# EAGLE design SimulatorT2InterfaceRevD (EAGLE 7.7.0)
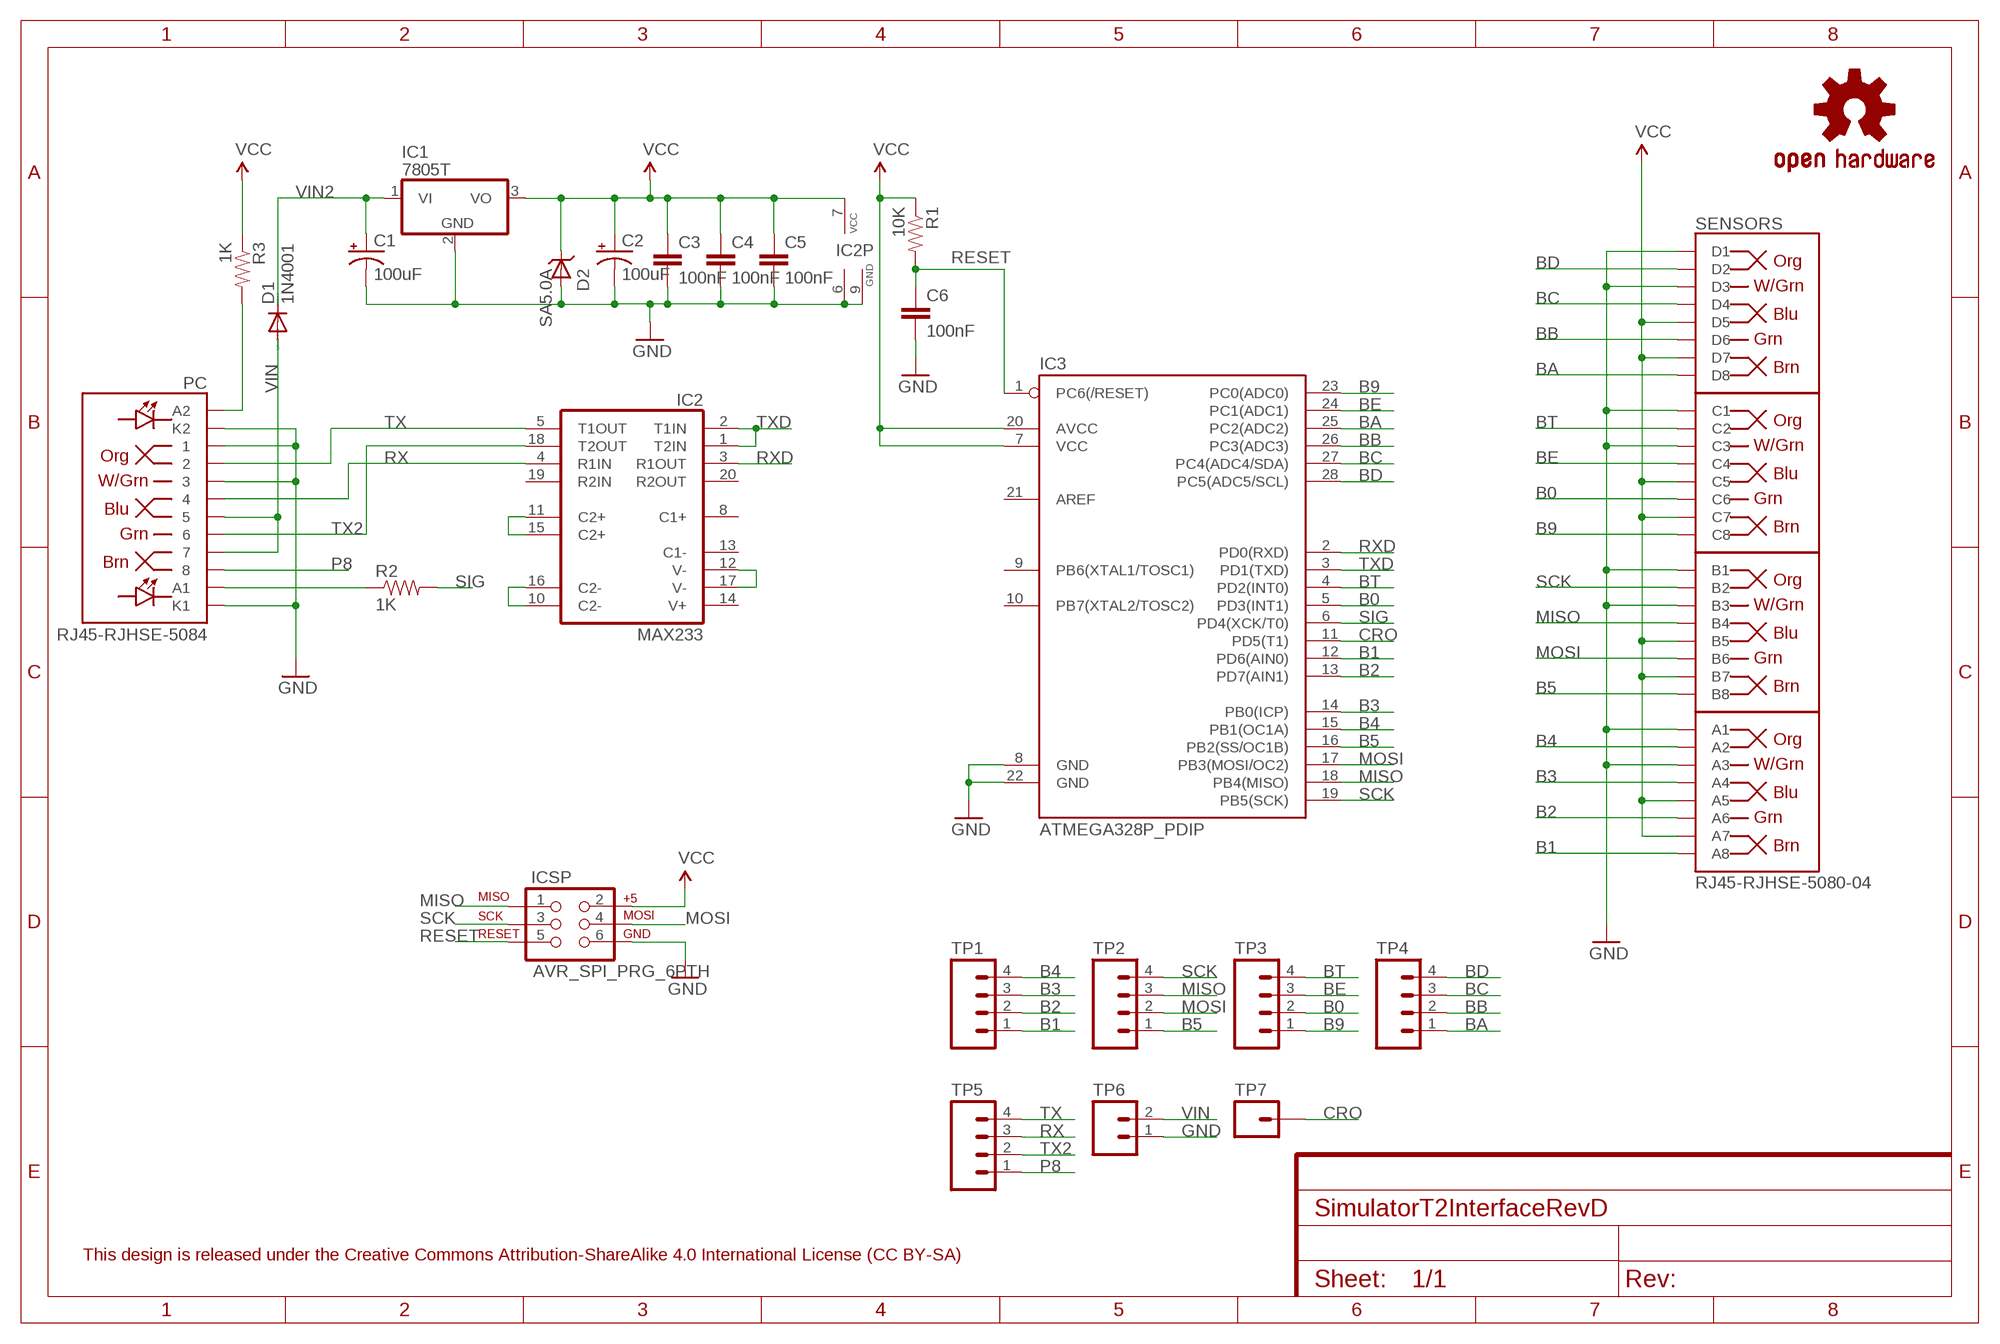
[diagram p0: schematic, sheet 1]
FRAME1 (FRAME-A4L): CNAME: Liverpool Simulator Type 2 Interface; CREVISION: Rev D 01/2019; DESIGNER: A J Instone-Cowie

## Parts
C1  100uF  CAP_POLPTH1  [CPOL-RADIAL-100UF-25V]
C2  100uF  CAP_POLPTH1  [CPOL-RADIAL-100UF-25V]
C3  100nF  CAPPTH  [CAP-PTH-SMALL]
C4  100nF  CAPPTH  [CAP-PTH-SMALL]
C5  100nF  CAPPTH  [CAP-PTH-SMALL]
C6  100nF  CAPPTH  [CAP-PTH-SMALL]
D1  1N4001  [DO41_DIODE]
D2  SA5.0A  [DO41_TVS_UNI]
IC1  7805T  [TO220H+TSR]
IC2  MAX233  [DIL20]
IC3  ATMEGA328P_PDIP  [DIL28-3]
ICSP  AVR_SPI_PRG_6PTH  [2X3]
LOGO1  OSHW-LOGOS  [OSHW-LOGO-S]
PC  RJ45-RJHSE-5084  [RJ45-RJHSE-5084]
R1  10K  RESISTORPTH-1/4W  [AXIAL-0.4]
R2  1K  RESISTORPTH-1/4W  [AXIAL-0.4]
R3  1K  RESISTORPTH-1/4W  [AXIAL-0.4]
SENSORS  RJ45-RJHSE-5080-04  [RJ45-RJHSE-5080-04]
TP1  M04PTH  [1X04]
TP2  M04PTH  [1X04]
TP3  M04PTH  [1X04]
TP4  M04PTH  [1X04]
TP5  M04PTH  [1X04]
TP6  M02PTH  [1X02]
TP7  M01PTH  [1X01]

## Nets
B0: IC3.5(PD3(INT1)) SENSORS.C6 TP3.2
B1: IC3.12(PD6(AIN0)) SENSORS.A8 TP1.1
B2: IC3.13(PD7(AIN1)) SENSORS.A6 TP1.2
B3: IC3.14(PB0(ICP)) SENSORS.A4 TP1.3
B4: IC3.15(PB1(OC1A)) SENSORS.A2 TP1.4
B5: IC3.16(PB2(SS/OC1B)) SENSORS.B8 TP2.1
B9: IC3.23(PC0(ADC0)) SENSORS.C8 TP3.1
BA: IC3.25(PC2(ADC2)) SENSORS.D8 TP4.1
BB: IC3.26(PC3(ADC3)) SENSORS.D6 TP4.2
BC: IC3.27(PC4(ADC4/SDA)) SENSORS.D4 TP4.3
BD: IC3.28(PC5(ADC5/SCL)) SENSORS.D2 TP4.4
BE: IC3.24(PC1(ADC1)) SENSORS.C4 TP3.3
BT: IC3.4(PD2(INT0)) SENSORS.C2 TP3.4
CRO: IC3.11(PD5(T1)) TP7.1
GND: C1.2(-) C2.2(-) C3.2 C4.2 C5.2 C6.2 D2.ANODE IC1.2(GND) IC2.6(GND) IC2.9(GND) IC3.8(GND) IC3.22(GND) ICSP.6 PC.1 PC.3 PC.K1 PC.K2 SENSORS.A1 SENSORS.A3 SENSORS.B1 SENSORS.B3 SENSORS.C1 SENSORS.C3 SENSORS.D1 SENSORS.D3 TP6.1
LED1: PC.A1 R2.P$1
LED2: PC.A2 R3.P$2
MISO: IC3.18(PB4(MISO)) ICSP.1 SENSORS.B4 TP2.3
MOSI: IC3.17(PB3(MOSI/OC2)) ICSP.4 SENSORS.B6 TP2.2
N$9: IC2.10(C2-) IC2.16(C2-)
N$13: IC2.11(C2+) IC2.15(C2+)
N$14: IC2.12(V-) IC2.17(V-)
P8: PC.8 TP5.1
RESET: C6.1 IC3.1(PC6(/RESET)) ICSP.5 R1.P$2
RX: IC2.4(R1IN) PC.4 TP5.3
RXD: IC2.3(R1OUT) IC3.2(PD0(RXD))
SCK: IC3.19(PB5(SCK)) ICSP.3 SENSORS.B2 TP2.4
SIG: IC3.6(PD4(XCK/T0)) R2.P$2
TX: IC2.5(T1OUT) PC.2 TP5.4
TX2: IC2.18(T2OUT) PC.6 TP5.2
TXD: IC2.1(T2IN) IC2.2(T1IN) IC3.3(PD1(TXD))
VCC: C2.1(+) C3.1 C4.1 C5.1 D2.CATHODE IC1.3(VO) IC2.7(VCC) IC3.7(VCC) IC3.20(AVCC) ICSP.2 R1.P$1 R3.P$1 SENSORS.A5 SENSORS.A7 SENSORS.B5 SENSORS.B7 SENSORS.C5 SENSORS.C7 SENSORS.D5 SENSORS.D7
VIN: D1.A PC.5 PC.7 TP6.2
VIN2: C1.1(+) D1.C IC1.1(VI)
Unconnected: IC2.8(C1+) IC2.13(C1-) IC2.14(V+) IC2.19(R2IN) IC2.20(R2OUT) IC3.9(PB6(XTAL1/TOSC1)) IC3.10(PB7(XTAL2/TOSC2)) IC3.21(AREF)

## Notes on the sheet
- This design is released under the Creative Commons Attribution-ShareAlike 4.0 International License (CC BY-SA)

## Library data of the parts
C1 C2 = SparkFun-Passives:CAP_POL: Capacitor Polarized These are standard SMD and PTH capacitors. Normally 10uF, 47uF, and 100uF in electrolytic and tantalum varieties. Always verify the external diameter of the through hole cap, it varies with capacity, voltage, and manufacturer. The EIA devices should be standard.
C3-C6 = SparkFun-Capacitors:CAP: Capacitor Standard 0603 ceramic capacitor, and 0.1" leaded capacitor.
D1 = AIC_Custom:1N4001: DIODE general purpose rectifier, 1 A
D2 = AIC_Custom:SA5.0A: SA5.0CA TVS Uni-Directional Transient Voltage Suppressor. 5V, DO41 package
IC1 = AIC_Custom:7805: Custom TO-220 Voltage Regulator Package has additional footprint on layer 51 tDocu showing outline of TSR-1-2450 switching regulator
IC2 = maxim:MAX233: RS232 TRANSCEIVER; MPN: MAX233ACPP+G36; OC_FARNELL: 1593332; OC_NEWARK: 89K3459
IC3 = SparkFun-DigitalIC:ATMEGA328P_PDIP: uC used in the Arduino 32kb flash, 1k EEPROM, 2k SRAM This is the through-hole version of this chip.
ICSP = SparkFun-Connectors:AVR_SPI_PRG_6: AVR ISP 6 Pin This is the reduced ISP connector for AVR programming. Common on Arduino. This footprint will take up less PCB space and can be used with a 10-pin to 6-pin adapter such as SKU: BOB-08508 **Special note about "TEST_POINT" package. The stop mask is on the top side, so if you want your programming test points to be on the bottom of your board, make sure to place this package on the bottom side of the board. This also ensure that the orientation to program from the bottom side will be correct.
LOGO1 = SparkFun-Aesthetics:OSHW-LOGO: Open Source Hardware Logo This logo indicates the piece of hardware it is found on incorporates a OSHW license and/or adheres to the definition of open source hardware found here: http://freedomdefined.org/OSHW
PC = AIC_Custom:RJ45-RJHSE-5084: Amphenol RJHSE-5084 RJ45 PCB Jack RJ45 8-pin connection PCB PTH connector, 90 degree, 2 LEDs
R1-R3 = SparkFun-Passives:RESISTOR: Resistor Basic schematic elements and footprints for 0603, 1206, and PTH resistors.
SENSORS = AIC_Custom:RJ45-RJHSE-5080-04: Amphenol RJHSE-x080 RJ45 PCB Jack (4-Port) RJ45 8-pin connection PCB PTH connector, 4-Port 90 degree package
TP1-TP5 = SparkFun-Connectors:M04: Header 4 Standard 4-pin 0.1" header. Use with straight break away headers (SKU : PRT-00116), right angle break away headers (PRT-00553), swiss pins (PRT-00743), machine pins (PRT-00117), and female headers (PRT-00115). Molex polarized connector foot print use with SKU : PRT-08231 with associated crimp pins and housings. 1MM SMD Version SKU: PRT-10208
TP6 = SparkFun-Connectors:M02: Standard 2-pin 0.1" header. Use with - straight break away headers ( PRT-00116) - right angle break away headers (PRT-00553) - swiss pins (PRT-00743) - machine pins (PRT-00117) - female headers (PRT-00115) Molex polarized connector foot print use with: PRT-08233 with associated crimp pins and housings. 2.54_SCREWTERM for use with PRT-10571. 3.5mm Screw Terminal footprints for PRT-08084 5mm Screw Terminal footprints for use with PRT-08432
TP7 = SparkFun-Connectors:M01: Header 1 Standard 1-pin 0.1" header. Use with straight break away headers (SKU : PRT-00116), right angle break away headers (PRT-00553), swiss pins (PRT-00743), machine pins (PRT-00117), and female headers (PRT-00115).

## Board
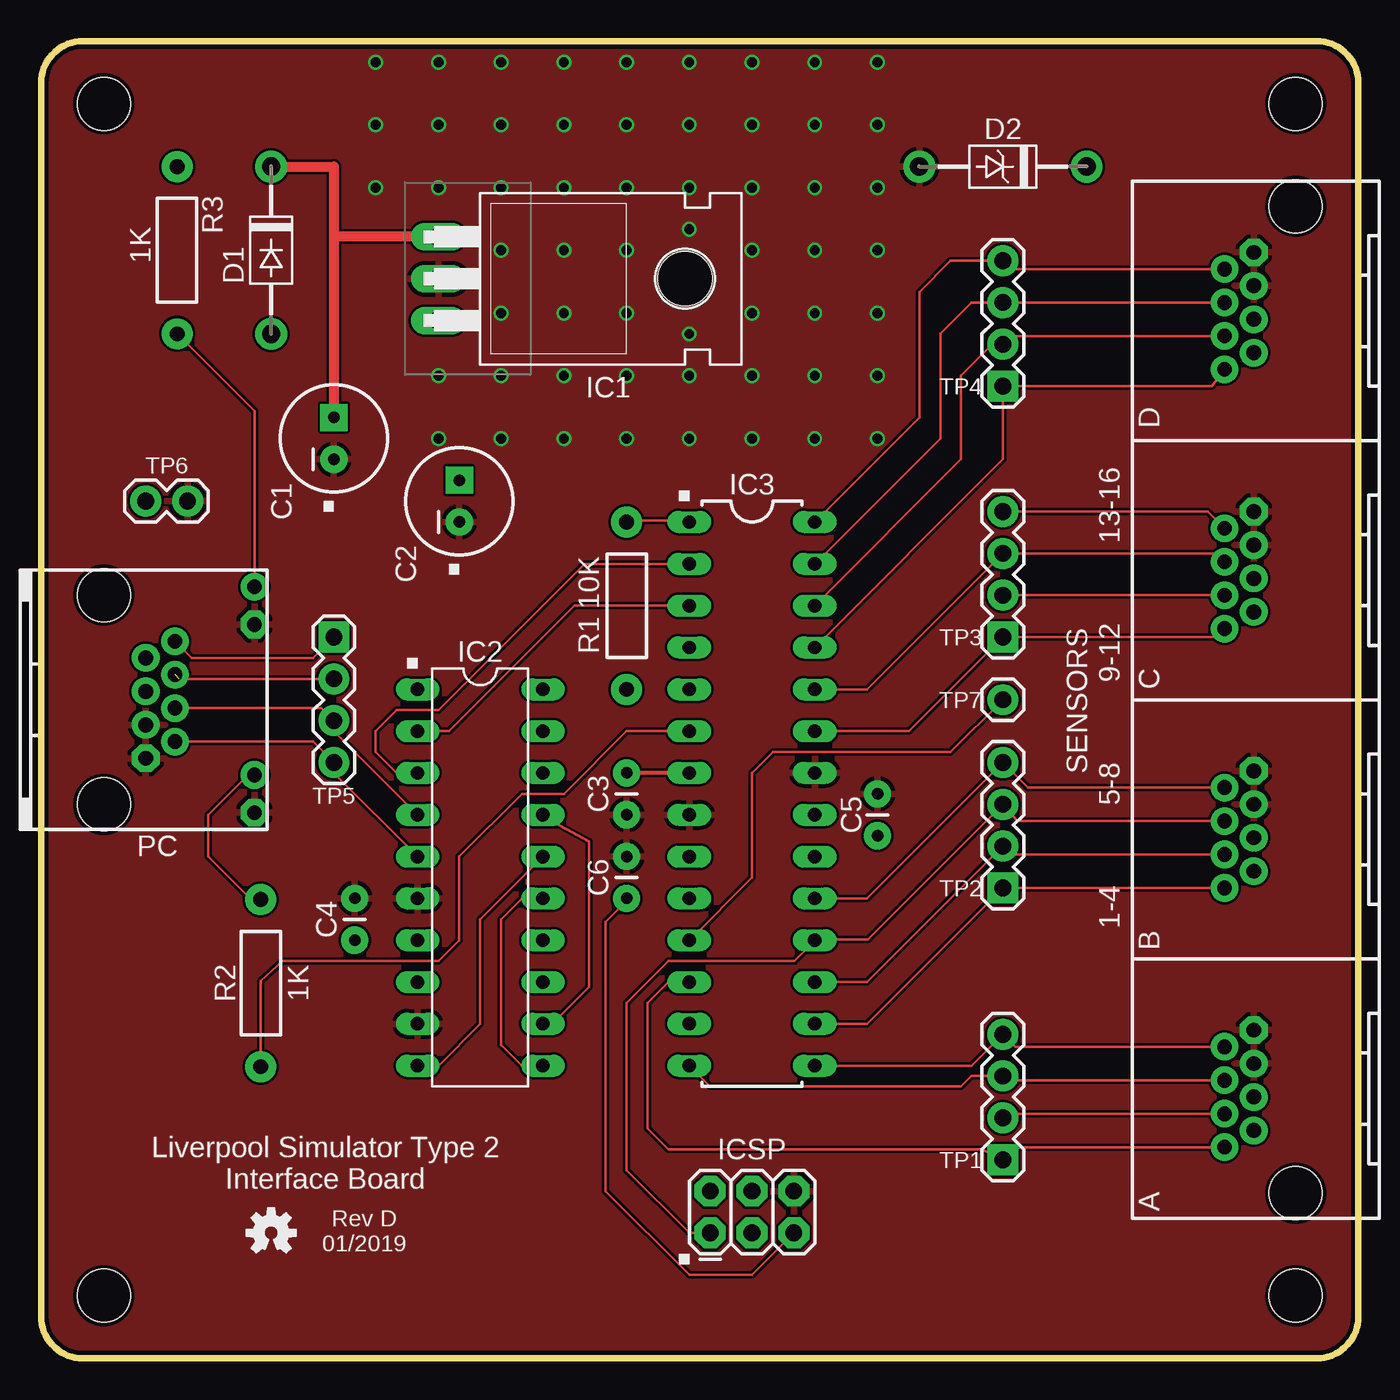
[diagram p1: board, top side]
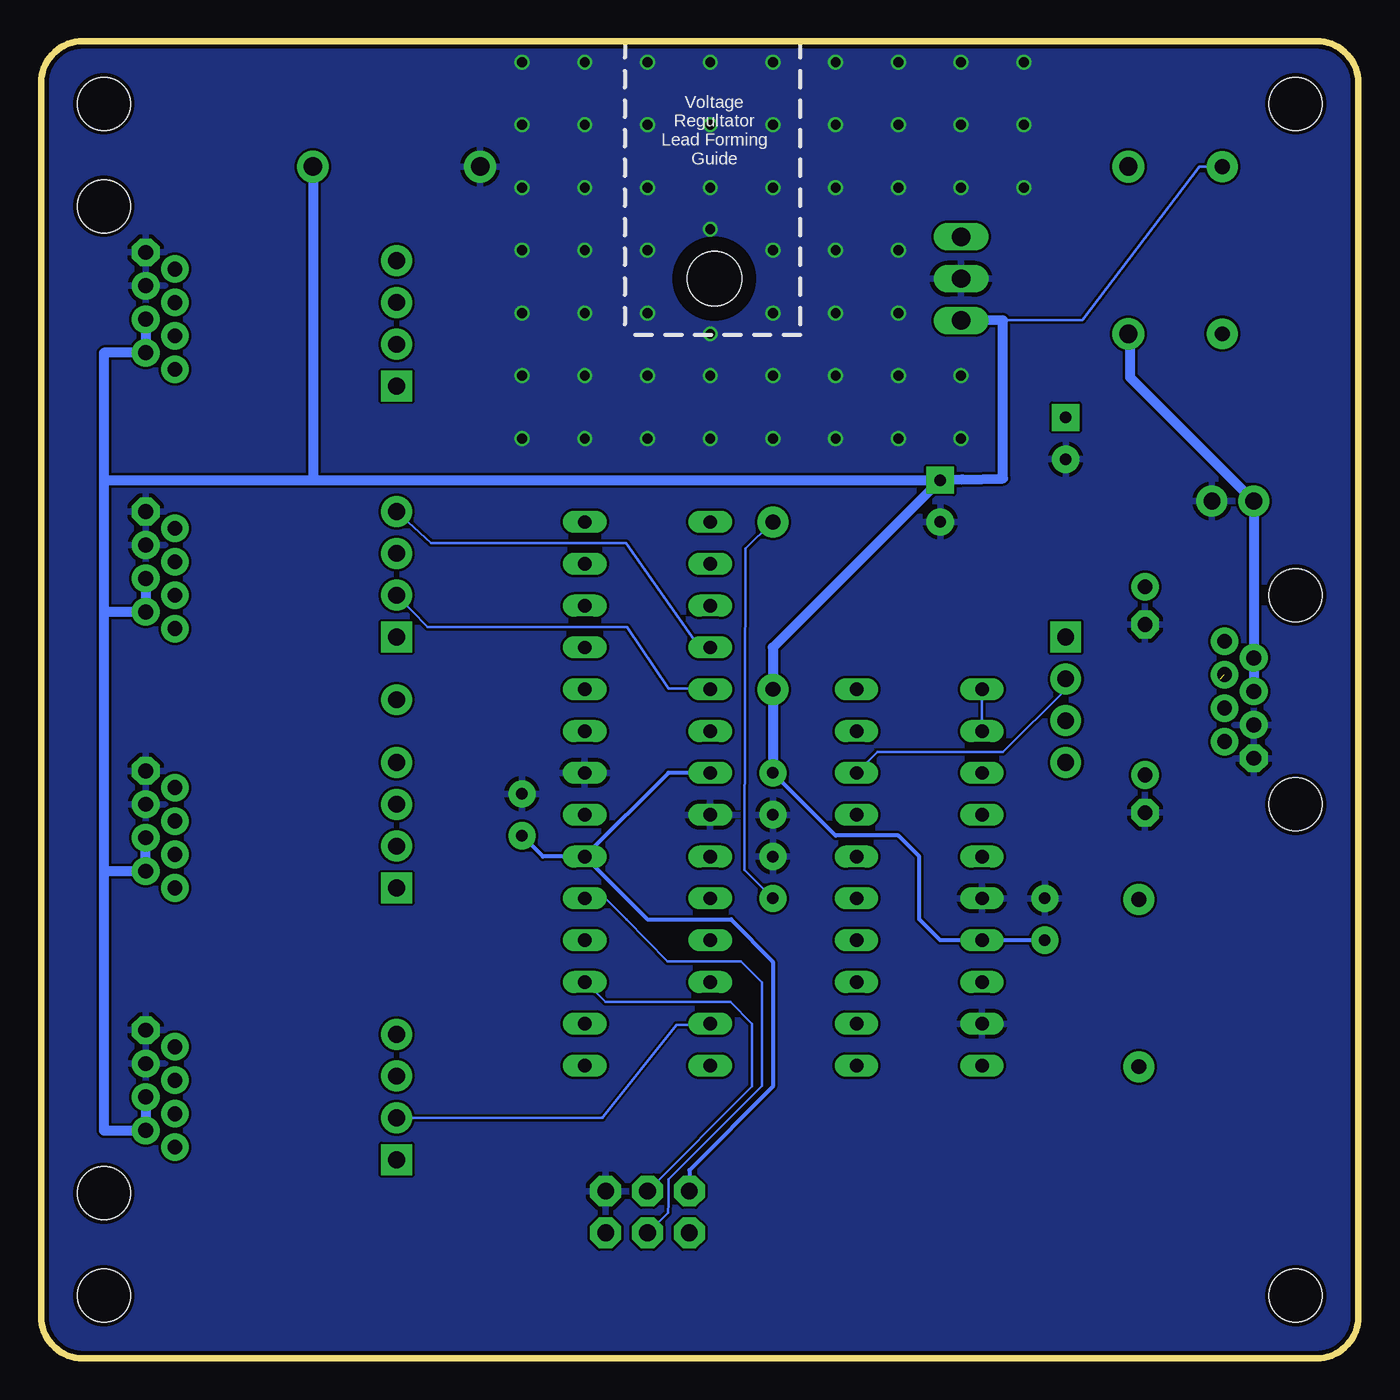
[diagram p2: board, bottom side, seen from below]

Size 80.01 x 80.01 mm. Coordinates in mm from the lower left corner, seen from the top.
Outline: 0,77.47 arc-90 2.54,80.01 77.47,80.01 arc-90 80.01,77.47 80.01,2.54 arc-90 77.47,0 2.54,0 arc-90 0,2.54 0,77.47
Copper layers (1*16): Top 0.035mm / dielectric 1.5mm / Bottom 0.035mm
Design rules "SeeedStudio_2layer_DRU_no_angle_20140221": minimum track width 6mil, minimum drill 12mil, track to track 6mil, track to pad 6mil, pad to pad 6mil, via to via 6mil, smd to smd 0mil, copper to edge 10mil, drill to drill 10mil, minimum pad ring 10mil, minimum via ring 6mil, stop-mask expansion 2mil, vias tented up to drill 100mil, thermal gap 10mil
Holes 3.2 mm at 3.81,76.2 76.2,76.2 76.2,3.81 3.81,3.81

### Footprints (pad centres in the part's own frame; a part is rotated, then mirrored left to right if it is on the bottom)
CPOL-RADIAL-100UF-25V = drill 0.7 pad 1.651 square: 1 1.27,0 | drill 0.7 pad 1.651: 2 -1.27,0
CAP-PTH-SMALL = drill 0.7 pad 1.651: 1 0,0; 2 2.54,0
DO41_DIODE = drill 1.118 pad 1.93: A 5.08,0; C -5.08,0
DO41_TVS_UNI = drill 1.118 pad 1.93: ANODE -5.08,0; CATHODE 5.08,0
TO220H+TSR = drill 1.118 long: 1 -2.54,-10.16; 2 0,-10.16; 3 2.54,-10.16 | hole 3.302: 0,4.826
DIL20 = drill 0.813 long: 1 -11.43,-3.81; 2 -8.89,-3.81; 3 -6.35,-3.81; 4 -3.81,-3.81; 5 -1.27,-3.81; 6 1.27,-3.81; 7 3.81,-3.81; 8 6.35,-3.81; 9 8.89,-3.81; 10 11.43,-3.81; 11 11.43,3.81; 12 8.89,3.81; 13 6.35,3.81; 14 3.81,3.81; 15 1.27,3.81; 16 -1.27,3.81; 17 -3.81,3.81; 18 -6.35,3.81; 19 -8.89,3.81; 20 -11.43,3.81
DIL28-3 = drill 0.813 long: 1 -16.51,-3.81; 2 -13.97,-3.81; 3 -11.43,-3.81; 4 -8.89,-3.81; 5 -6.35,-3.81; 6 -3.81,-3.81; 7 -1.27,-3.81; 8 1.27,-3.81; 9 3.81,-3.81; 10 6.35,-3.81; 11 8.89,-3.81; 12 11.43,-3.81; 13 13.97,-3.81; 14 16.51,-3.81; 15 16.51,3.81; 16 13.97,3.81; 17 11.43,3.81; 18 8.89,3.81; 19 6.35,3.81; 20 3.81,3.81; 21 1.27,3.81; 22 -1.27,3.81; 23 -3.81,3.81; 24 -6.35,3.81; 25 -8.89,3.81; 26 -11.43,3.81; 27 -13.97,3.81; 28 -16.51,3.81
2X3 = drill 1.016 pad 1.88 octagon: 1 0,0; 2 0,2.54; 3 2.54,0; 4 2.54,2.54; 5 5.08,0; 6 5.08,2.54
RJ45-RJHSE-5084 = drill 0.9 pad 1.676 octagon: 1 3.556,2.54; K1 6.858,9.144; K2 -4.572,9.144 | drill 0.9 pad 1.676: 2 2.54,4.318; 3 1.524,2.54; 4 0.508,4.318; 5 -0.508,2.54; 6 -1.524,4.318; 7 -2.54,2.54; 8 -3.556,4.318; A1 4.572,9.144; A2 -6.858,9.144 | hole 3.2: -6.35,0; 6.35,0
AXIAL-0.4 = drill 0.9 pad 1.88: P$1 -5.08,0; P$2 5.08,0
RJ45-RJHSE-5080-04 = drill 0.9 pad 1.676 octagon: A1 -20.066,2.54; B1 -4.318,2.54; C1 11.43,2.54; D1 27.178,2.54 | drill 0.9 pad 1.676: A2 -21.082,4.318; A3 -22.098,2.54; A4 -23.114,4.318; A5 -24.13,2.54; A6 -25.146,4.318; A7 -26.162,2.54; A8 -27.178,4.318; B2 -5.334,4.318; B3 -6.35,2.54; B4 -7.366,4.318; B5 -8.382,2.54; B6 -9.398,4.318; B7 -10.414,2.54; B8 -11.43,4.318; C2 10.414,4.318; C3 9.398,2.54; C4 8.382,4.318; C5 7.366,2.54; C6 6.35,4.318; C7 5.334,2.54; C8 4.318,4.318; D2 26.162,4.318; D3 25.146,2.54; D4 24.13,4.318; D5 23.114,2.54; D6 22.098,4.318; D7 21.082,2.54; D8 20.066,4.318 | hole 3.2: -29.972,0; 29.972,0
1X04 = drill 1.016 pad 1.88 square: 1 0,0 | drill 1.016 pad 1.88: 2 2.54,0; 3 5.08,0; 4 7.62,0
1X02 = drill 1.016 pad 1.88: 1 0,0; 2 2.54,0
1X01 = drill 1.016 pad 1.88: 1 0,0

### Placement (x,y rotation side)
C1  17.78,55.88 90 top
C2  25.4,52.07 90 top
C3  35.56,35.56 270 top
C4  19.05,25.4 90 top
C5  50.8,31.75 90 top
C6  35.56,27.94 90 top
D1  13.97,67.31 270 top
D2  58.42,72.39 0 top
IC1  34.29,65.58 270 top
IC2  26.67,29.21 270 top
IC3  43.18,34.29 270 top
ICSP  40.64,7.62 0 top
LOGO1  13.97,7.62 0 top
PC  3.81,40.01 270 top
R1  35.56,45.72 90 top
R2  13.34,22.8 270 top
R3  8.26,67.31 270 top
SENSORS  76.2,40.01 90 top
TP1  58.42,12.06 90 top
TP2  58.42,28.57 90 top
TP3  58.42,43.81 90 top
TP4  58.42,59.05 90 top
TP5  17.78,43.81 270 top
TP6  8.89,52.07 180 top
TP7  58.42,40.01 0 top

### Tracks (layer width: path | path; a pad name or v marks a point on that pad's centre or on a via)
B0
  Top 0.152: TP3.2 SENSORS.C6
  Bottom 0.152: TP3.2 56.54,44.42 44.44,44.42 41.91,40.69 39.47,40.69 IC3.5
B1
  Top 0.152: IC3.12 38.1,22.86 36.83,21.59 36.83,13.97 38.1,12.7 57.15,12.7 TP1.1 59.18,12.83 SENSORS.A8
B2
  Top 0.152: TP1.2 58.67,14.86 SENSORS.A6
  Bottom 0.152: IC3.13 39.47,20.27 41.4,20.27 45.87,14.66 45.92,14.61 TP1.2
B3
  Top 0.152: SENSORS.A4 58.67,16.89 TP1.3 56.52,17.14 55.88,16.51 40.64,16.51 IC3.14
B4
  Top 0.152: SENSORS.A2 59.18,18.92 TP1.4 56.52,17.78 IC3.15
B5
  Top 0.152: SENSORS.B8 TP2.1 50.16,20.32 IC3.16
B9
  Top 0.152: IC3.23 52.7,38.1 TP3.1 71.37,43.81 SENSORS.C8
BA
  Top 0.152: SENSORS.D8 71.12,59.05 TP4.1 58.42,54.61 IC3.25
BB
  Top 0.152: SENSORS.D6 59.05,62.1 TP4.2 57.78,61.59 55.88,59.69 55.88,54.61 IC3.26
BC
  Top 0.152: SENSORS.D4 TP4.3 56.52,64.14 54.61,62.23 54.61,55.88 IC3.27
BD
  Top 0.152: SENSORS.D2 58.8,66.17 TP4.4 55.24,66.67 53.34,64.77 53.34,57.15 IC3.28
BE
  Top 0.152: IC3.24 50.16,40.64 TP3.3 71.37,48.9 SENSORS.C4
BT
  Top 0.152: TP3.4 70.87,51.44 SENSORS.C2
  Bottom 0.152: IC3.4 39.47,43.28 40.08,43.28 44.48,49.52 56.31,49.52 TP3.4
CRO
  Top 0.152: IC3.11 43.18,29.21 43.18,35.56 44.45,36.83 55.24,36.83 TP7.1
GND  (via drill 0.6 pad 0.25)
  other vias: 43.18,67.31 27.94,78.74 27.94,67.31 27.94,71.12 27.94,74.93 31.75,78.74 31.75,74.93 31.75,71.12 31.75,67.31 31.75,63.5 27.94,63.5 27.94,59.69 31.75,59.69 35.56,67.31 35.56,71.12 35.56,74.93 35.56,78.74 35.56,63.5 35.56,59.69 39.37,59.69 43.18,59.69 39.37,62.23 43.18,63.5 39.37,71.12 43.18,71.12 39.37,74.93 43.18,74.93 39.37,78.74 43.18,78.74 46.99,78.74 46.99,74.93 46.99,71.12 46.99,67.31 46.99,63.5 46.99,59.69 27.94,55.88 31.75,55.88 35.56,55.88 39.37,55.88 43.18,55.88 46.99,55.88 24.13,78.74 24.13,74.93 50.8,78.74 50.8,74.93 50.8,71.12 50.8,67.31 50.8,63.5 50.8,59.69 50.8,55.88 24.13,59.69 24.13,55.88 39.37,68.58 24.13,71.12 20.32,78.74 20.32,74.93 20.32,71.12
  pour Bottom: 0,77.47 arc-90 2.54,80.01 77.47,80.01 arc-90 80.01,77.47 80.01,2.54 arc-90 77.47,0 2.54,0 arc-90 0,2.54
  pour Top: 0,77.47 arc-90 2.54,80.01 77.47,80.01 arc-90 80.01,77.47 80.01,2.54 arc-90 77.47,0 2.54,0 arc-90 0,2.54
LED1
  Top 0.152: 12.76,27.88 10.16,30.48 10.16,33.02 12.57,35.43 PC.A1
  Top 0.406: 12.76,27.88 R2.P$1
LED2
  Top 0.152: R3.P$2 12.95,57.53 PC.A2
MISO
  Top 0.152: ICSP.1 39.37,7.62 35.56,11.43 35.56,21.59 38.1,24.13 45.77,24.13 46.94,25.3 IC3.18 47.09,25.45 50.22,25.45 TP2.3 59.31,32.64 SENSORS.B4
MOSI
  Top 0.152: SENSORS.B6 58.99,30.61 TP2.2 50.16,22.86 IC3.17
  Bottom 0.152: 43.13,10.21 ICSP.4 36.83,16.51 36.83,20.32 38.15,21.64 45.72,21.64 46.94,22.86 IC3.17
N$9
  Top 0.152: IC2.16 26.67,26.67 26.67,20.32 24.13,17.78 IC2.10
N$13
  Top 0.152: IC2.11 29.21,17.78 27.94,19.05 27.94,26.67 29.21,27.94 IC2.15
N$14
  Top 0.152: IC2.17 30.48,32.92 33.27,31.39 33.27,22.55 31.04,20.32 IC2.12
P8
  Top 0.152: TP5.1 16.51,42.55 9.14,42.55 PC.8
RESET
  Top 0.152: IC3.1 39.32,50.9 35.66,50.9 R1.P$2 | C6.1 35.66,27.89 34.29,26.52 34.29,10.16 39.37,5.08 43.18,5.08 ICSP.5
  Bottom 0.152: 35.66,28.04 C6.1 37.3,29.68 37.3,30.09 37.24,49.17 35.66,50.75 R1.P$2
RX
  Top 0.152: 22.86,33.07 IC2.4 17.78,38.1 TP5.3 17.02,39.5 PC.4
RXD
  Top 0.152: IC3.2 33.02,48.26 24.13,39.37 21.59,39.37 20.32,38.1 20.32,36.83 21.59,35.56 IC2.3
SCK
  Top 0.152: SENSORS.B2 59.94,34.67 TP2.4 50.16,27.94 IC3.19
  Bottom 0.152: IC3.19 45.72,27.94 44.45,26.67 41.95,24.11 37.5,24.11 36.22,22.82 36.22,16.56 41.91,10.87 41.91,9.44 41.92,8.85 43.13,7.62 ICSP.3
SIG
  Top 0.152: IC3.6 35.56,38.1 31.75,34.29 29.21,34.29 25.4,30.48 25.4,25.4 24.13,24.13 14.67,24.13 13.34,22.92 R2.P$2
TX
  Top 0.152: PC.2 16.51,37.47 TP5.4 17.78,35.56 IC2.5
TX2  (1 unrouted)
  Top 0.152: 8.38,41.27 TP5.2
  Bottom 0.152: IC2.18 29.21,36.83 21.59,36.83 17.78,40.64 TP5.2
TXD
  Top 0.152: IC2.2 24.79,38.1 32.41,45.72 IC3.3
  Bottom 0.152: IC2.1 IC2.2
VCC
  Top 0.254: IC3.7 C3.1
  Bottom 0.152: R3.P$1 9.65,72.39 16.76,63.06 21.59,63.06 | 35.51,40.69 R1.P$1
  Bottom 0.254: IC3.20 49.53,30.48 C5.1 | 35.66,35.66 C3.1 31.75,31.75 27.94,31.75 26.67,30.48 26.67,26.67 25.4,25.4 IC2.7 C4.1 | IC3.20 43.18,26.67 38.1,26.67 35.56,24.07 35.56,16.51 40.64,11.43 ICSP.2 | IC3.7 41.91,35.56 IC3.20
  Bottom 0.61: C2.1 24.08,53.39 21.59,53.44 21.59,63.06 IC1.3 | C2.1 35.56,43.18 R1.P$1 C3.1 | SENSORS.D5 SENSORS.D7 76.2,61.09 76.2,53.34 | 76.2,53.34 76.2,45.34 | 76.2,45.34 76.2,29.59 | 76.2,29.59 76.2,13.84 SENSORS.A7 SENSORS.A5 | SENSORS.C5 SENSORS.C7 76.2,45.34 | 76.2,53.34 63.5,53.34 | D2.CATHODE 63.5,53.34 | SENSORS.B5 SENSORS.B7 76.2,29.59 | 63.5,53.34 C2.1
VIN
  Bottom 0.152: 13.87,62.18 D1.A
  Bottom 0.61: PC.5 PC.7 TP6.2 13.87,59.59 13.87,62.18
VIN2
  Top 0.152: 14.02,72.39 D1.C
  Top 0.406: 17.78,68.12 17.78,68.58
  Top 0.61: 14.02,72.39 17.78,72.39 17.78,68.58 C1.1 | IC1.1 17.78,68.12

### Text on the board
tPlace: 1-4 5-8 9-12 13-16 | Liverpool Simulator Type 2 / Interface Board | Rev D / 01/2019
bPlace: Voltage / Regultator / Lead Forming / Guide